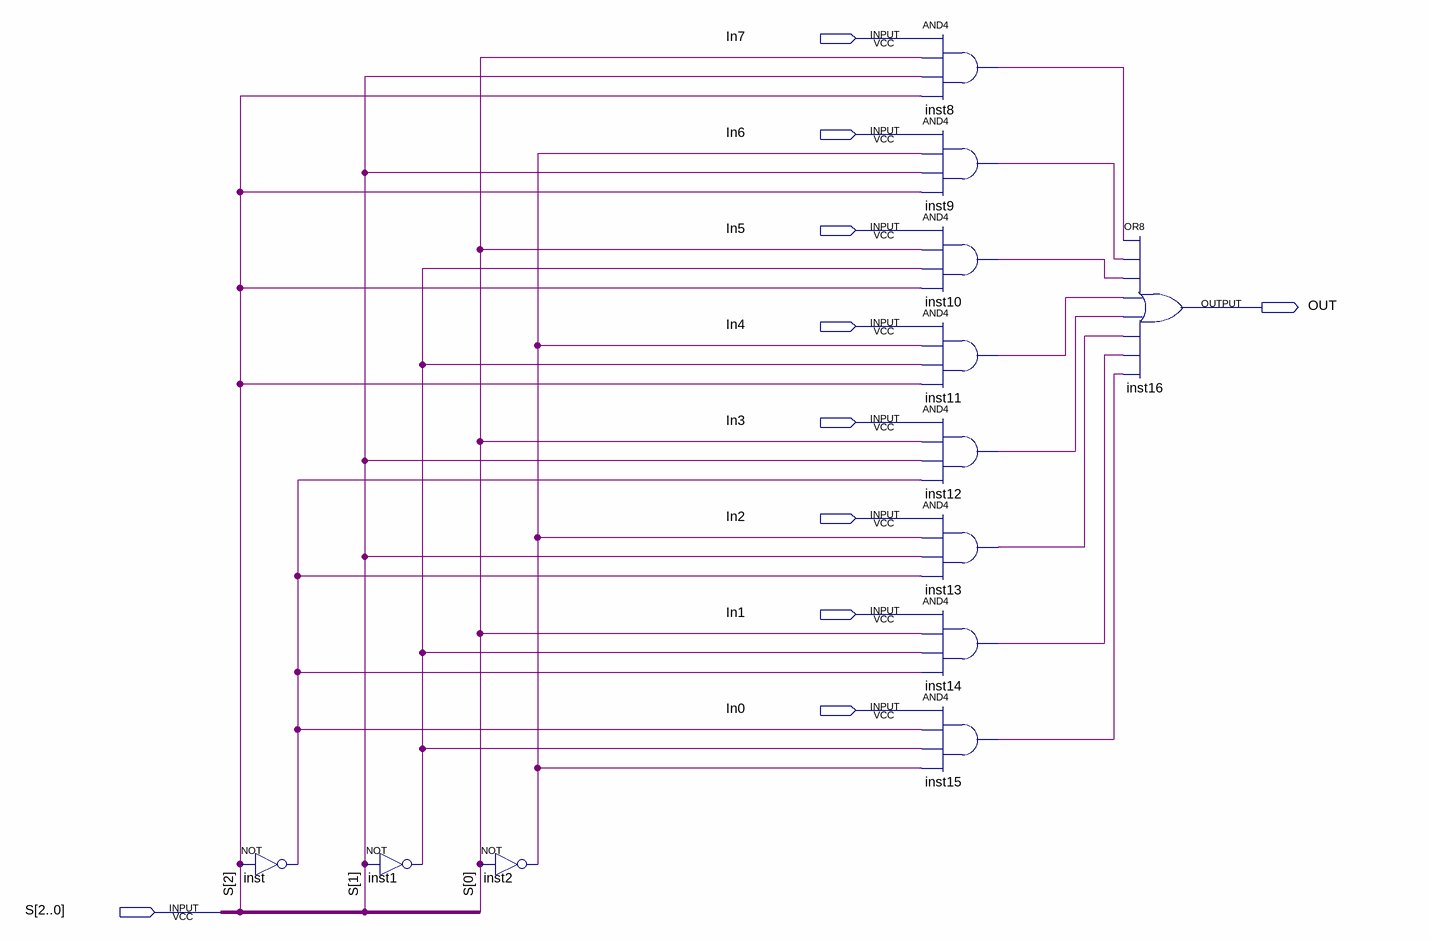
[diagram p0: schematic sheet]
// Quartus schematic 8x1Mux.bdf as structural Verilog: 12 symbols, 10 pins
module \8x1Mux  (
  input  In7,
  input  In6,
  input  In5,
  input  In4,
  input  In3,
  input  In2,
  input  In1,
  input  In0,
  input  [2:0] S,
  output OUT
);

  wire inst1_out, inst2_out, inst8_out, inst9_out, inst10_out, inst11_out, inst12_out, inst13_out,
       inst14_out, inst15_out, inst_out;

  not inst (inst_out, S[2]);
  not inst1 (inst1_out, S[1]);
  not inst2 (inst2_out, S[0]);
  and inst8 (inst8_out, In7, S[0], S[1], S[2]);
  and inst9 (inst9_out, In6, inst2_out, S[1], S[2]);
  and inst10 (inst10_out, In5, S[0], inst1_out, S[2]);
  and inst11 (inst11_out, In4, inst2_out, inst1_out, S[2]);
  and inst12 (inst12_out, In3, S[0], S[1], inst_out);
  and inst13 (inst13_out, In2, inst2_out, S[1], inst_out);
  and inst14 (inst14_out, In1, S[0], inst1_out, inst_out);
  and inst15 (inst15_out, In0, inst_out, inst1_out, inst2_out);
  or inst16 (OUT, inst8_out, inst9_out, inst10_out, inst11_out, inst12_out, inst13_out, inst14_out, inst15_out);
endmodule
